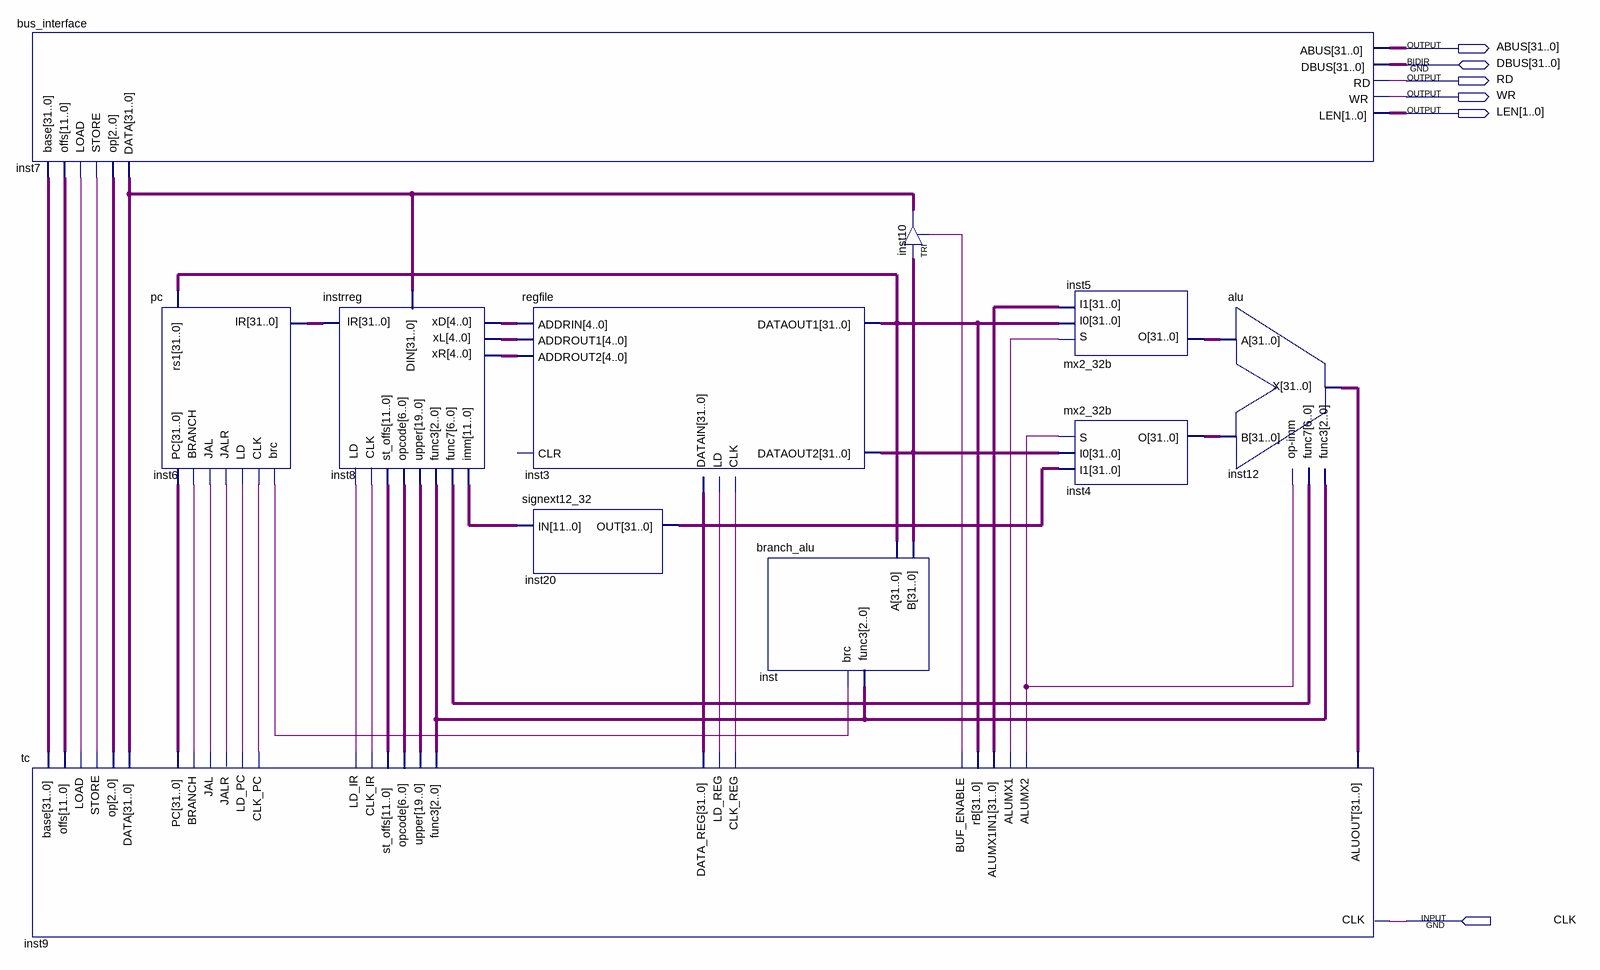
[diagram p0: schematic sheet]
// Quartus schematic rv32i.bdf as structural Verilog: 11 symbols, 6 pins
module rv32i (
  input  CLK,
  inout  [31:0] DBUS,
  output [31:0] ABUS,
  output RD,
  output WR,
  output [1:0] LEN
);

  wire inst9_alumx1, inst9_alumx2, inst9_branch, inst9_buf_enable, inst9_clk_ir, inst9_clk_pc, inst9_clk_reg,
       inst9_jal, inst9_jalr, inst9_ld_ir, inst9_ld_pc, inst9_ld_reg, inst9_load, inst9_store, inst_brc;
  wire [2:0] inst8_func3, inst9_op;
  wire [4:0] inst8_xd, inst8_xl, inst8_xr;
  wire [6:0] inst8_func7, inst8_opcode;
  wire [11:0] inst8_imm, inst8_st_offs, inst9_offs;
  wire [19:0] inst8_upper;
  wire [31:0] inst3_dataout1, inst3_dataout2, inst4_o, inst5_o, inst6_pc, inst7_data, inst8_ir,
       inst9_alumx1in1, inst9_base, inst9_data_reg, inst12_x, inst20_out;

  bus_interface inst7 (
    .base(inst9_base), .offs(inst9_offs), .LOAD(inst9_load), .STORE(inst9_store), .op(inst9_op), .ABUS(ABUS),
    .RD(RD), .WR(WR), .LEN(LEN), .DBUS(DBUS), .DATA(inst7_data));
  tc inst9 (
    .st_offs(inst8_st_offs), .func3(inst8_func3), .opcode(inst8_opcode), .CLK(CLK), .ALUOUT(inst12_x),
    .upper(inst8_upper), .DATA(inst7_data), .PC(inst6_pc), .rB(inst3_dataout1), .op(inst9_op),
    .CLK_PC(inst9_clk_pc), .CLK_IR(inst9_clk_ir), .CLK_REG(inst9_clk_reg), .ALUMX1IN1(inst9_alumx1in1),
    .LD_PC(inst9_ld_pc), .LD_IR(inst9_ld_ir), .ALUMX1(inst9_alumx1), .LD_REG(inst9_ld_reg),
    .BRANCH(inst9_branch), .DATA_REG(inst9_data_reg), .JAL(inst9_jal), .ALUMX2(inst9_alumx2),
    .JALR(inst9_jalr), .LOAD(inst9_load), .STORE(inst9_store), .BUF_ENABLE(inst9_buf_enable),
    .base(inst9_base), .offs(inst9_offs));
  pc inst6 (
    .brc(inst_brc), .BRANCH(inst9_branch), .JAL(inst9_jal), .JALR(inst9_jalr), .IR(inst8_ir),
    .rs1(inst3_dataout1), .LD(inst9_ld_pc), .CLK(inst9_clk_pc), .PC(inst6_pc));
  instrreg inst8 (
    .DIN(inst7_data), .LD(inst9_ld_ir), .CLK(inst9_clk_ir), .IR(inst8_ir), .opcode(inst8_opcode),
    .func7(inst8_func7), .xR(inst8_xr), .xL(inst8_xl), .func3(inst8_func3), .xD(inst8_xd), .imm(inst8_imm),
    .upper(inst8_upper), .st_offs(inst8_st_offs));
  regfile inst3 (
    .LD(inst9_ld_reg), .ADDRIN(inst8_xd), .DATAIN(inst9_data_reg), .CLK(inst9_clk_reg), .ADDROUT1(inst8_xl),
    .ADDROUT2(inst8_xr), .DATAOUT2(inst3_dataout2), .DATAOUT1(inst3_dataout1));  // open: CLR
  signext12_32 inst20 (.IN(inst8_imm), .OUT(inst20_out));
  branch_alu inst (.A(inst3_dataout1), .B(inst3_dataout2), .func3(inst8_func3), .brc(inst_brc));
  TRI inst10[31:0] (.IN(inst3_dataout2), .OE(inst9_buf_enable), .OUT(inst7_data));
  mx2_32b inst5 (.S(inst9_alumx1), .I0(inst3_dataout1), .I1(inst9_alumx1in1), .O(inst5_o));
  mx2_32b inst4 (.S(inst9_alumx2), .I0(inst3_dataout2), .I1(inst20_out), .O(inst4_o));
  alu inst12 (
    .A(inst5_o), .B(inst4_o), .func3(inst8_func3), .\op-imm (inst9_alumx2), .func7(inst8_func7), .X(inst12_x));
endmodule
